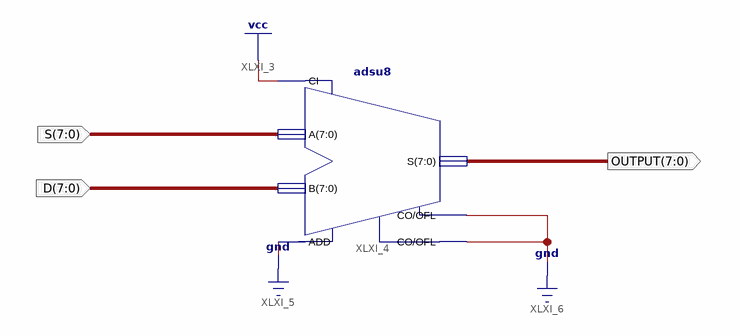
[diagram p0: schematic sheet 1]
// Xilinx ISE schematic SUB.sch (spartan6) as structural Verilog: 1 symbols, 3 ports
module SUB (
  input  [7:0] S,
  input  [7:0] D,
  output [7:0] OUTPUT
);

  adsu8 XLXI_4 (.A(S), .ADD(1'b0), .B(D), .CI(1'b1), .CO(1'b0), .OFL(1'b0), .S(OUTPUT));
endmodule
